# EasyEDA schematic SCH_fridge-door-alarm_2024-07-15.json
TITLE: Sheet_1; REV: 1.0; Date: 2024-07-15; Sheet: 1/1; Drawn By: garihc24own; Company: Your Company
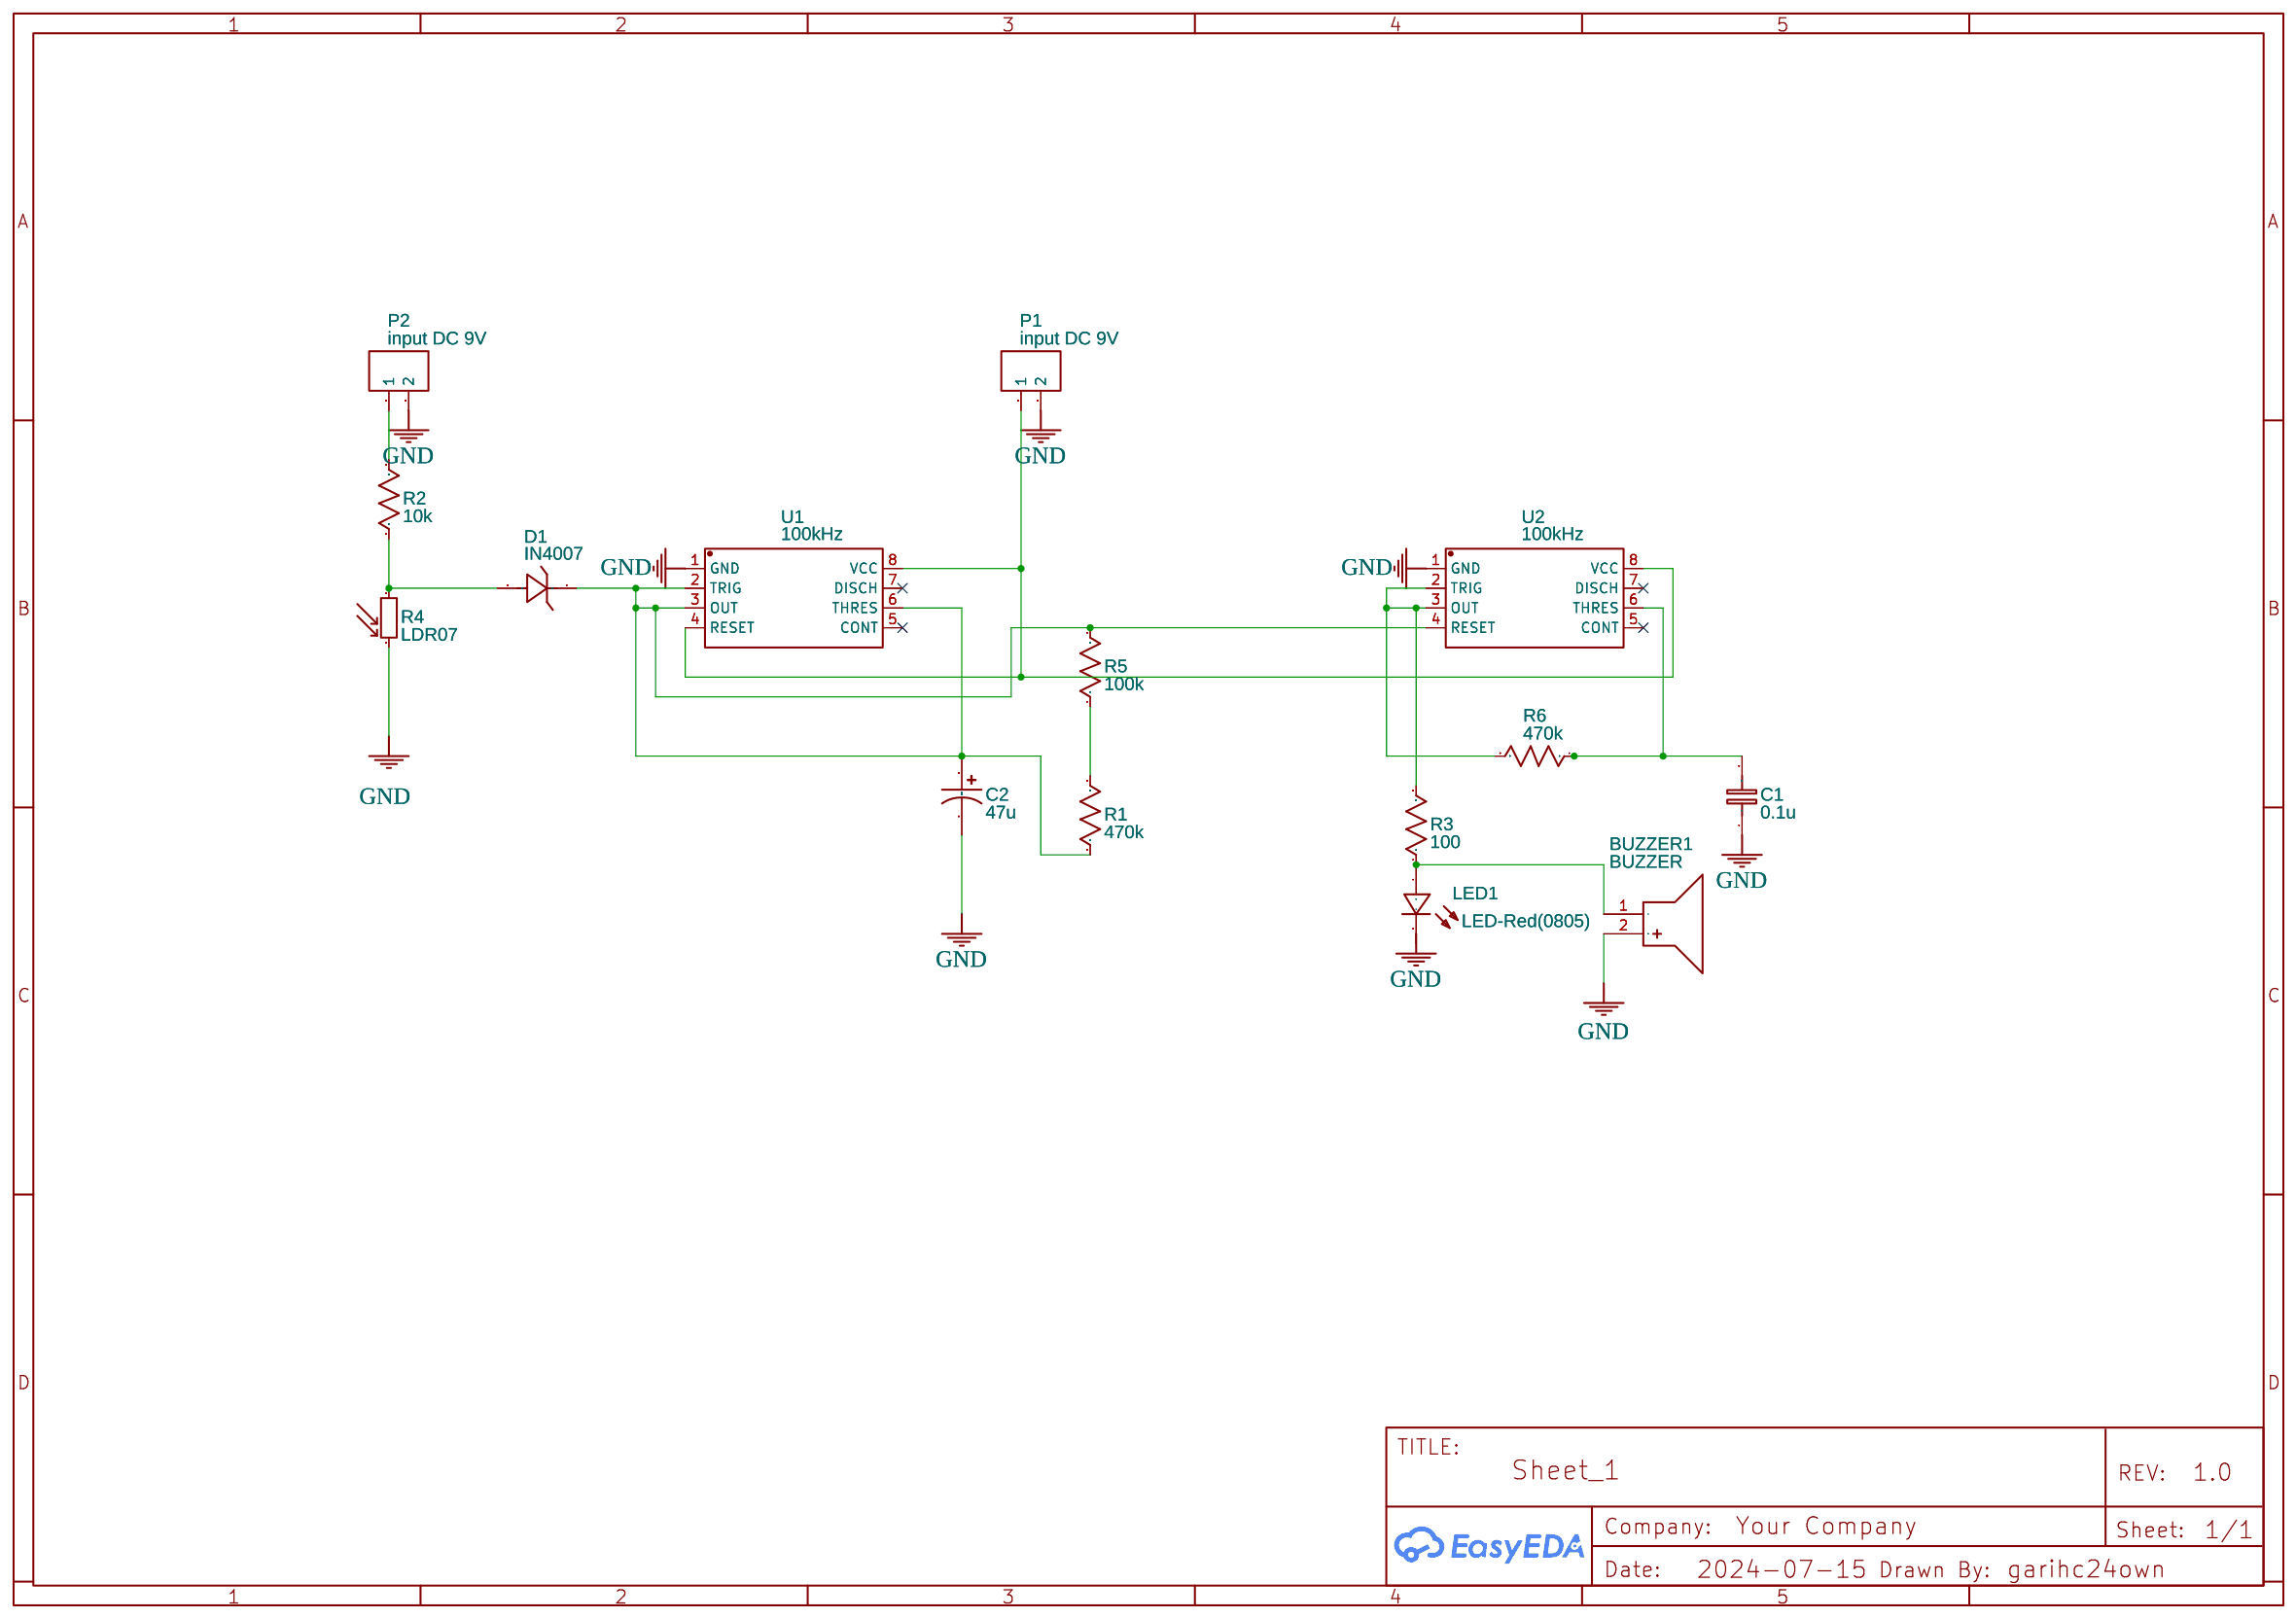
[diagram p0: schematic sheet]

## Parts
BUZZER1  BUZZER  [BUZ-TH_BD12.0-P6.00-D0.9-RD]
C1  0.1u  [C0603]
C2  47u  [CASE-A_3216]
D1  IN4007  [SMA_L4.3-W2.6-LS5.1-RD]
LED1  LED-Red(0805)  [LED-0805]
P1  input DC 9V  [CONN-TH_2P-P5.00]
P2  input DC 9V  [CONN-TH_2P-P5.00]
R1  470k  [R0603]
R2  10k  [R_AXIAL-0.4]
R3  100  [R0603]
R4  LDR07  [RESISTOR_LDR_5.1X4.3_RM3.4]
R5  100k  [R0603]
R6  470k  [R0603]
U1  100kHz  [SOIC-8_L5.0-W4.0-P1.27-LS6.0-BL]
U2  100kHz  [SOIC-8_L5.0-W4.0-P1.27-LS6.0-BL]

## Library data of the parts
BUZZER1 = BUZZER: Contributor: lcsc; Supplier: LCSC; Supplier Part: C9900014030; Manufacturer: null; Manufacturer Part: buzzer; JLCPCB Part Class: Extended Part
C1 = C_0603_EU: Contributor: LCEDA_Lib
C2 = C_Tan_SMD_A_US: Contributor: LCEDA_Lib
D1 = IN4007: Contributor: LCSC; Supplier: LCSC; Supplier Part: C9900004719; Manufacturer: null; JLCPCB Part Class: Extended Part
LED1 = LED-Red(0805): Supplier: LCSC; Manufacturer: Everlight Elec; Manufacturer Part: 17-21SURC/S530-A2/TR8; Supplier Part: C131244
P1 P2 = CONN-TH_2P-P5.00: Supplier: LCSC; Contributor: LCEDA_Lib
R1 R3 R5 R6 = R_0603_US: Contributor: LCEDA_Lib
R2 = R_AXIAL-0.4_US: Contributor: LCEDA_Lib
R4 = LDR07: Contributor: KiCAD; license: https://www.gnu.org/licenses/lgpl-2.1.html
U1 U2 = NE555D: Contributor: LCSC; Supplier: LCSC; Supplier Part: C234230; Manufacturer: TI(德州仪器); JLCPCB Part Class: Extended Part

## Nets
GND: BUZZER1.2(+) C1.1 C2.2 P1.2 P2.2 R4.2 U1.1(GND) U2.1(GND)
Net-(BUZZER1-1): BUZZER1.1(-) LED1.1(+) R3.1
Net-(C1-2): C1.2 R6.1 U2.6(THRES)
Net-(C2-1): C2.1 D1.1(C) R1.1 R5.2 U1.2(TRIG) U1.3(OUT) U1.6(THRES) U2.4(RESET)
Net-(D1-2): D1.2(A) R2.1 R4.1
Net-(P1-1): P1.1 U1.4(RESET) U1.8(VCC) U2.8(VCC)
Net-(P2-1): P2.1 R2.2
Net-(R1-2): R1.2 R5.1
Net-(R3-2): R3.2 R6.2 U2.2(TRIG) U2.3(OUT)

Not connected (* = marked no-connect by the designer): LED1 2(-); U1 5(CONT)* 7(DISCH)*; U2 5(CONT)* 7(DISCH)*
